# EAGLE design esp-rgbw (EAGLE 9.6.2)
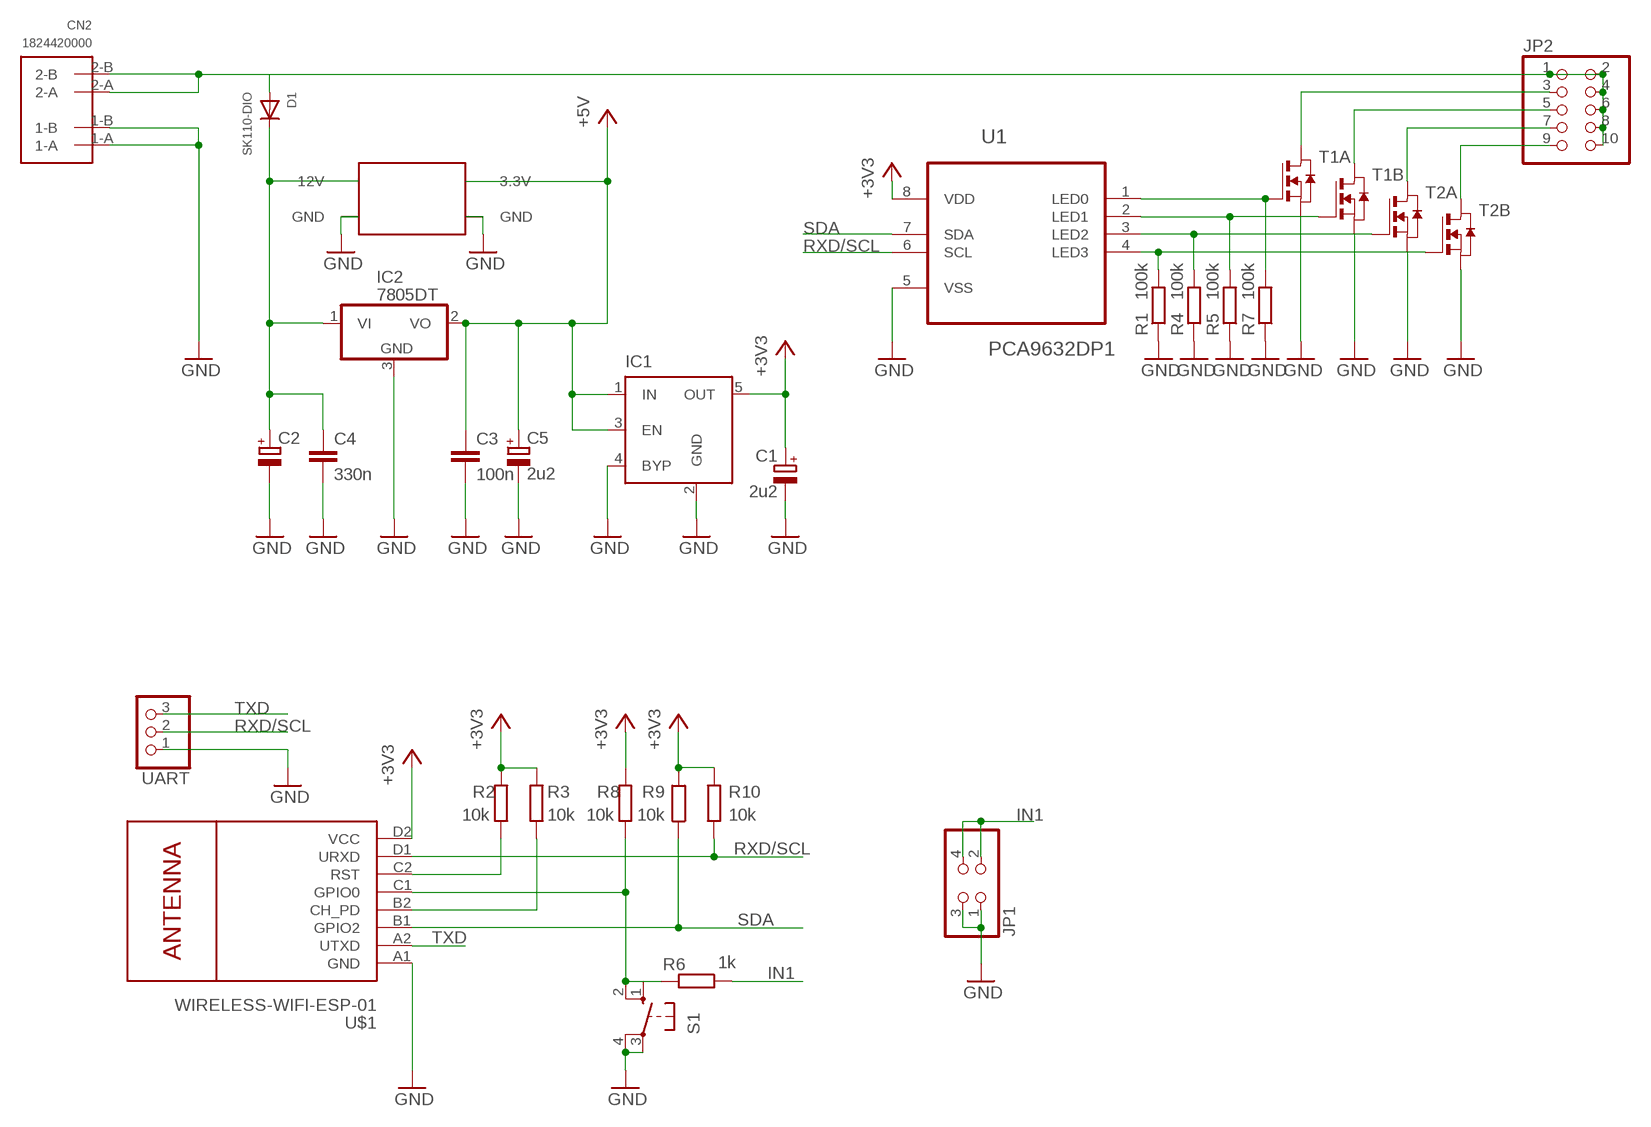
[diagram p0: schematic, sheet 1]

## Parts
C1  2u2  CPOL-EUSMCB  [SMC_B]
C2  CPOL-EUC/6032-28R  [C/6032-28R]
C3  100n  C-EUC0805  [C0805]
C4  330n  C-EUC0805  [C0805]
C5  2u2  CPOL-EUSMCB  [SMC_B]
CN2  1824420000  [1824420000]
D1  SK110-DIO  DIODESMA  [SMADIODE]
IC1  MIC5219XX  [SOT23-5]
IC2  7805DT  [TO252]
JP1  PINHD-2X2  [2X02]
JP2  PINHD-2X5  [2X05]
R1  100k  R-EU_R0805  [R0805]
R2  10k  R-EU_R0805  [R0805]
R3  10k  R-EU_R0805  [R0805]
R4  100k  R-EU_R0805  [R0805]
R5  100k  R-EU_R0805  [R0805]
R6  1k  R-EU_R0805  [R0805]
R7  100k  R-EU_R0805  [R0805]
R8  10k  R-EU_R0805  [R0805]
R9  10k  R-EU_R0805  [R0805]
R10  10k  R-EU_R0805  [R0805]
S1  10-XX  [B3F-10XX]
T1  NMOS2SO8  [SO8]
T2  NMOS2SO8  [SO8]
U1  PCA9632DP1  [SOP65P490X110-8N]
U$1  WIRELESS-WIFI-ESP-01  [WIRELESS-WIFI-ESP-01]
U$2  MP2307-MINI-360  [MP2307-MINI-360]
UART  PINHD-1X3  [1X03]

## Nets
+3V3: C1.+ IC1.5(OUT) R2.2 R3.2 R8.2 R9.2 R10.2 U1.8(VDD) U$1.D2(VCC)
+5V: C3.1 C5.+ IC1.1(IN) IC1.3(EN) IC2.2(VO) U$2.3.3V
GND: C1.- C2.- C3.2 C4.2 C5.- CN2.1-A CN2.1-B IC1.2(GND) IC1.4(BYP) IC2.3(GND) JP1.1 JP1.3 R1.1 R4.1 R5.1 R7.1 S1.3(P) S1.4(P1) T1.1(A:S) T1.3(B:S) T2.1(A:S) T2.3(B:S) U1.5(VSS) U$1.A1(GND) U$2.GND@1(GND) U$2.GND@2(GND) UART.1
IN1: JP1.2 JP1.4 R6.1
N$1: R3.1 U$1.B2(CH_PD)
N$2: R2.1 U$1.C2(RST)
N$4: R6.2 R8.1 S1.1(S) S1.2(S1) U$1.C1(GPIO0)
N$7: JP2.3 T1.7(A:D) T1.8(A:D)
N$8: JP2.5 T1.5(B:D) T1.6(B:D)
N$9: C2.+ C4.1 D1.C IC2.1(VI) U$2.12V
N$10: JP2.7 T2.7(A:D) T2.8(A:D)
N$12: JP2.9 T2.5(B:D) T2.6(B:D)
N$13: R1.2 T2.4(B:G) U1.4(LED3)
N$14: R4.2 T2.2(A:G) U1.3(LED2)
N$16: R5.2 T1.4(B:G) U1.2(LED1)
N$17: R7.2 T1.2(A:G) U1.1(LED0)
OUT+: CN2.2-A CN2.2-B D1.A JP2.1 JP2.2 JP2.4 JP2.6 JP2.8 JP2.10
RXD/SCL: R10.1 U1.6(SCL) U$1.D1(URXD) UART.2
SDA: R9.1 U1.7(SDA) U$1.B1(GPIO2)
TXD: U$1.A2(UTXD) UART.3

## Library data of the parts
C1 C2 C5 = rcl:CPOL-EU: POLARIZED CAPACITOR, European symbol; SPICEPREFIX: C
C3 C4 = rcl:C-EU: CAPACITOR, European symbol; SPICEPREFIX: C
CN2 = 1824420000:1824420000: Check availability <https://pricing.snapeda.com/parts/1824420000/Weidmuller/view-part?ref=eda>; AVAILABILITY: In Stock; CHECK_PRICES: https://www.snapeda.com/parts/1824420000/Weidmuller/view-part/?ref=eda; DESCRIPTION: 2 Position Wire to Board Terminal Block Horizontal with Board 0.138 (3.50mm) Through Hole; MF: Weidmuller; MP: 1824420000; PACKAGE: None; PRICE: None; SNAPEDA_LINK: https://www.snapeda.com/parts/1824420000/Weidmuller/view-part/?ref=snap
D1 = adafruit:DIODE: Diode SMADIODE - SMA Surface Mount Package 20V 1A Schottky Diode Digikey: 641-1014-6-ND DO-1N4148 - Through Hole Small Current Diode SOD-123 20V 1 A (.5mV Vf) Schottky Diode - Digikey: MBRX120TPMSCT-ND SOD-323 10V 570mA (.38mV Vf, 3ns) Schottky Diode - Digikey: ZLLS410CT-ND SOD-523 30V 30mA Schottky Diode (RB751S-40TE61) - Digikey: RB751S-40TE61CT-ND SOT23-R/W - SOT23 Package (R = Solder Paste/Reflow Ovens, W = Hand-Soldering) BAT54Film 40V 300mA - Digikey: 497-7162-1-ND
IC1 = v-reg-micrel:MIC5219XX: VOLTAGE REGULATOR; OC_FARNELL: unknown; OC_NEWARK: unknown
IC2 = linear:78*: Positive VOLTAGE REGULATOR Source: http://cache.national.com/ds/LM/LM78L05.pdf http://www.fairchildsemi.com/ds/LM/LM7805.pdf
JP1 = pinhead:PINHD-2X2: PIN HEADER
JP2 = pinhead:PINHD-2X5: PIN HEADER
R1-R10 = rcl:R-EU_: RESISTOR, European symbol; SPICEPREFIX: R
S1 = switch-omron:10-XX: OMRON SWITCH; MPN: B3F-1000; OC_FARNELL: 176432; OC_NEWARK: 36M3542
T1 T2 = zetex:NMOS2: Dual MOS FET; OC_FARNELL: unknown; OC_NEWARK: unknown
U1 = PCA9632DP1_118:PCA9632DP1
U$1 = diy-modules:WIRELESS-WIFI-ESP-01: Wireless Wi-Fi ESP-01 Module based on ESP8266 chip Click here to find device on ebay.com <http://www.ebay.com/sch/esp8266+esp+01+transceiver>
U$2 = MP2307-MINI-360:MP2307-MINI-360
UART = adafruit:PINHD-1X3: PIN HEADER

## Board
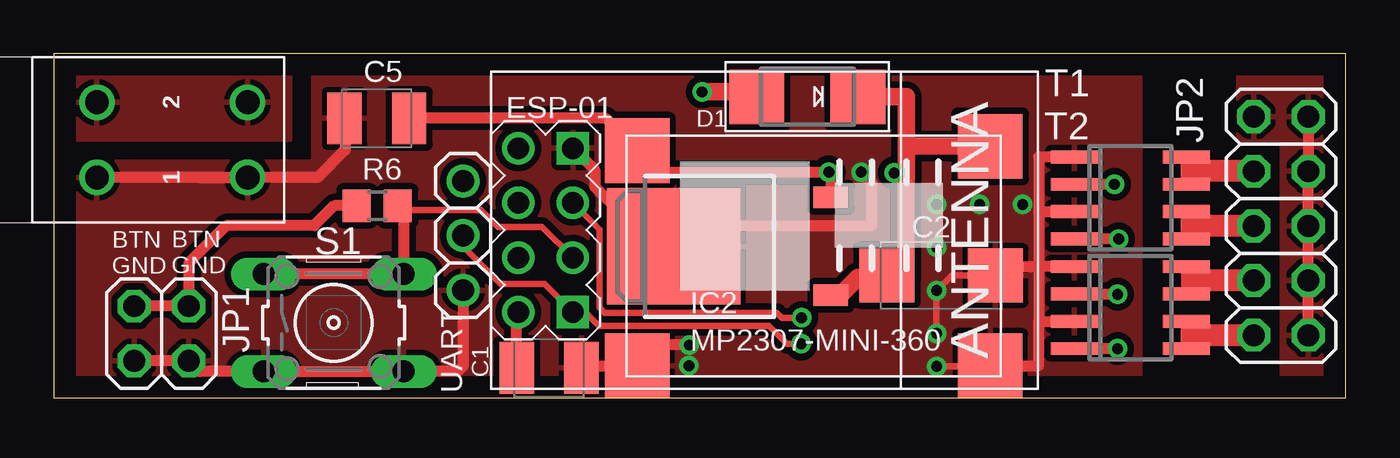
[diagram p1: board, top side]
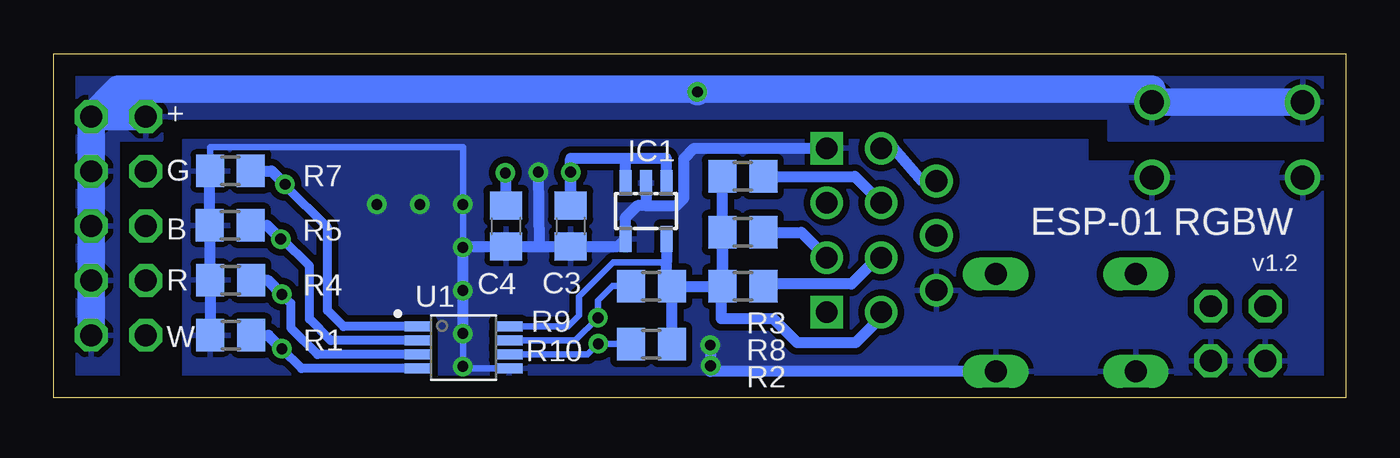
[diagram p2: board, bottom side, seen from below]

Size 60 x 16 mm. Coordinates in mm from the lower left corner, seen from the top.
Outline: 0,0 60,0 60,16 0,16 0,0
Copper layers (1*16): Top 0.035mm / dielectric 1.5mm / Bottom 0.035mm
Design rules "default *": minimum track width 6mil, minimum drill 0.35mm, track to track 12mil, track to pad 8mil, pad to pad 8mil, via to via 8mil, smd to smd 8mil, copper to edge 40mil, drill to drill 6mil, minimum pad ring 10mil, minimum via ring 8mil, stop-mask expansion 4mil, vias tented up to drill 0mil, thermal gap 10mil

### Footprints (pad centres in the part's own frame; a part is rotated, then mirrored left to right if it is on the bottom)
SMC_B = smd 1.6 x 2.4: + -1.5,0; - 1.5,0
C/6032-28R = smd 2.55 x 2.5: + 2.525,0; - -2.525,0
C0805 = smd 1.3 x 1.5: 1 -0.95,0; 2 0.95,0
1824420000 = drill 1.1: 1-A 1.75,3.5; 1-B 1.75,-3.5; 2-A -1.75,3.5; 2-B -1.75,-3.5
SMADIODE = smd 2.54 x 2.54: A 2.349,0; C -2.349,0
SOT23-5 = smd 0.55 x 1.2: 1 -0.95,-1.3; 2 0,-1.3; 3 0.95,-1.3; 4 0.95,1.3; 5 -0.95,1.3
TO252 = smd 1 x 1.6: 1 -2.28,-4.8; 2 2.28,-4.8 | smd 5.4 x 6.2: 3 0,2.5
2X02 = drill 1.016 octagon: 1 -1.27,-1.27; 2 -1.27,1.27; 3 1.27,-1.27; 4 1.27,1.27
2X05 = drill 1.016 octagon: 1 -5.08,-1.27; 2 -5.08,1.27; 3 -2.54,-1.27; 4 -2.54,1.27; 5 0,-1.27; 6 0,1.27; 7 2.54,-1.27; 8 2.54,1.27; 9 5.08,-1.27; 10 5.08,1.27
R0805 = smd 1.3 x 1.5: 1 -0.95,0; 2 0.95,0
B3F-10XX = drill 1.016 long: 1 -3.251,2.261; 2 3.251,2.261; 3 -3.251,-2.261; 4 3.251,-2.261
SO8 = smd 0.6 x 2.2: 1 -1.905,-2.6; 2 -0.635,-2.6; 3 0.635,-2.6; 4 1.905,-2.6; 5 1.905,2.6; 6 0.635,2.6; 7 -0.635,2.6; 8 -1.905,2.6
SOP65P490X110-8N = smd 1.25 x 0.46: 1 -2.11,0.975; 2 -2.11,0.325; 3 -2.11,-0.325; 4 -2.11,-0.975; 5 2.11,-0.975; 6 2.11,-0.325; 7 2.11,0.325; 8 2.11,0.975
WIRELESS-WIFI-ESP-01 = drill 1 square: A1 -8.89,3.81; D1 -8.89,-3.81 | drill 1: A2 -11.43,3.81; B1 -8.89,1.27; B2 -11.43,1.27; C1 -8.89,-1.27; C2 -11.43,-1.27; D2 -11.43,-3.81
MP2307-MINI-360 = smd 3 x 3: 3.3V 0.5,10.5; 12V 16.9,10.7; GND@1 16.9,0.5; GND@2 0.5,0.5
1X03 = drill 1.016: 1 -2.54,0; 2 0,0; 3 2.54,0

### Placement (x,y rotation side)
C1  23,1.4 0 top
C2  41.21,5.7 180 top
C3  36,8 270 bottom
C4  39,8 270 bottom
C5  15,13 180 top
CN2  5.5,12 270 top
D1  35,14 180 top
IC1  32.5,8.7 180 bottom
IC2  31.29,7.05 90 top
JP1  5,3 0 top
JP2  57,8 270 top
R1  51.78,2.92 0 bottom
R2  27.99,5.2 180 bottom
R3  28,10.3 180 bottom
R4  51.79,5.48 0 bottom
R5  51.81,8.03 0 bottom
R6  15.02,8.94 0 top
R7  51.8,10.56 0 bottom
R8  28,7.7 180 bottom
R9  32.25,5.2 0 bottom
R10  32.25,2.5 0 bottom
S1  13,3.5 0 top
T1  50,9.3 270 top
T2  50,4.2 270 top
U1  40.97,2.35 0 bottom
U$1  33,7.8 0 top
U$2  26.59,1 0 top
UART  19.01,7.55 90 top

### Tracks (layer width: path | path; a pad name or v marks a point on that pad's centre or on a via)
+3V3
  Top 0.508: C1.+ 21.5,3.72 U$1.D2
  Bottom 0.305: U1.8 36.12,3.33 35.6,3.85 35.6,4.73 34.02,6.31 31.55,6.31 | R9.2 31.55,5.45
  Bottom 0.508: U$1.D2 21.57,3.76 22.75,2.58 25.47,2.58 26.59,3.7 29,3.7 29,5.19 | R2.2 28.94,10.6 R3.2 | 29,5.19 29,5.2 R2.2 | R8.2 R2.2 | 29,5.19 31.28,5.19 R9.2 R10.2 | IC1.5 31.55,6.31 31.55,5.45
+5V  (via drill 0.5)
  Top 0.508: 35.85,10.5 28,10.5 28,10.59 U$2.3.3V 27.09,11.54 25.63,13 C5.+ | 35.85,10.5 v36,10.5 | IC2.2 36.09,10.26 35.85,10.5
  Bottom 0.508: IC1.1 31.55,11.14 33.45,11.14 | 33.45,11.14 36,11.14 C3.1 v36,10.5 | IC1.3 33.45,11.14
GND  (via drill 0.5)
  Top 0.305: U$2.GND@1 43.46,1.47 v41,1.47 | v41,3 v41,5 41.7,5.7 C2.-
  Top 0.508: 6.77,10.25 CN2.1-A | CN2.1-A CN2.1-B | 29,8 28,7 28.78,7 IC2.3 | 29,8 37.95,8 38,8.05 38,10 v37.5,10.5 | UART.1 19.01,1.5 18.78,1.27 16.25,1.27 16.22,1.24 S1.3 6.76,1.24 JP1.3 JP1.1 | C1.- 24.6,1.5 U$2.GND@2 27.5,1.5 | 27.5,1.5 27.73,1.27 28,1.27 | C5.- 13.54,12.96 13.54,11.54 12.25,10.25 CN2.1-A | U$1.A1 25.13,10.59 25.13,9.81 25.94,9 29,9 29,8 | v29.51,2.46 28.46,2.46 27.5,1.5 | T1.1 45.74,11.21 45.74,8.66 | 45.74,8.66 T1.3 | 45.74,8.66 45.74,6.11 | 45.74,6.11 45.74,3.56 | 45.74,3.56 T2.3 | T2.1 45.74,6.11 | C2.- 43.73,6.11 45.74,6.11 | U$2.GND@1 45.74,1.5 45.74,3.56
  Bottom 0.305: U1.5 40.91,1.38 v41,1.47 v41,3 | R7.1 52.75,11.67 49.84,11.67 49.84,11.66 41,11.66 41,7.05
  Bottom 0.508: 37.49,7.05 C4.2 41,7.05 v41,3 | 37.49,7.05 C3.2 | C3.2 36,6.83 | IC1.2 32.49,8.94 | C3.2 33.8,7.05 IC1.4 33.45,8.39 32.9,8.94 32.49,8.94 | v37.5,10.5 37.46,7.08 37.49,7.05 | R1.1 R4.1 52.74,8.01 R5.1 R7.1 | S1.4 29.51,1.24 v29.51,2.46 | 32.49,8.94 31.09,8.94 30.74,9.29 30.74,11.13 30.26,11.61 U$1.A1
  other vias: 43,9 45,9 41,9 41,7 29.5,1.5
  pour Top: 12,16 12,11.04 0,11.04 0,0 50.51,0 50.51,16
  pour Bottom: 0,11 12,11 12,12 54,12 54,0 0,0
IN1
  Top 0.508: JP1.2 JP1.4 6.27,6.27 8.01,8.01 12.1,8.01 13.03,8.94 R6.1
N$1
  Bottom 0.508: R3.1 22.8,10.3 U$1.B2
N$2
  Bottom 0.508: U$1.C2 21.69,6.53 21.74,6.51 22.96,5.29 26.75,5.29 R2.1
N$4
  Top 0.305: U$1.C1 22.68,7.96 20.63,7.96 19.84,8.75 16.25,8.75 S1.2
  Top 0.508: S1.1 S1.2 16.25,8.66 R6.2
  Bottom 0.508: R8.1 25.28,7.7 U$1.C1
N$7
  Top 0.508: T1.7 52.6,10.54 | 52.6,10.54 T1.8 | 53,10.54 52.6,10.54
  Top 1.016: JP2.3 53,10.54
N$8
  Top 0.508: T1.5 52.6,8 | 52.6,8 T1.6 | 53,8 52.6,8
  Top 1.016: JP2.5 53,8
N$9  (via drill 0.5)
  Top 0.508: 39.57,10.24 39.35,10.46 v39.03,10.46 39.27,10.21 39.59,10.21 | U$2.12V 43,11.7
  Top 0.813: IC2.1 36.51,4.77 37.35,5.61 38.81,5.61 C2.+ 39.57,5.58 39.57,10.24 | D1.C 39.59,14 39.59,11.7 | 39.59,11.7 39.59,10.21 | 43,11.7 39.59,11.7
  Bottom 0.508: C4.1 39,10.43 v39.03,10.46
N$10
  Top 0.508: T2.8 52.6,5.48 | 52.6,5.48 T2.7 | 53,5.46 52.62,5.46 52.6,5.48
  Top 1.016: JP2.7 53,5.46
N$12
  Top 0.508: T2.5 52.6,3 | 52.6,3 T2.6 | 53,3 52.6,3
  Top 1.016: JP2.9 53.08,2.92 53,3
N$13  (via drill 0.5)
  Top 0.508: v49.41,2.29 T2.4
  Bottom 0.406: U1.4 48.49,1.38 v49.41,2.29
  Bottom 0.508: R1.2 50.04,2.92 v49.41,2.29
N$14  (via drill 0.5)
  Top 0.508: v49.41,4.82 47.41,4.82 T2.2
  Bottom 0.406: U1.3 47.76,2.02 48.99,3.26 48.99,4.4 v49.41,4.82
  Bottom 0.508: R4.2 50.07,5.48 v49.41,4.82
N$16  (via drill 0.5)
  Top 0.508: v49.46,7.39 T1.4
  Bottom 0.406: U1.2 47.13,2.67 48.13,3.67 48.13,6.13 49.39,7.39 v49.46,7.39
  Bottom 0.508: R5.2 50.1,8.03 v49.46,7.39
N$17  (via drill 0.5)
  Top 0.508: v49.26,9.93 T1.2
  Bottom 0.406: U1.1 46.55,3.33 47.29,4.07 47.29,7.91 49.26,9.89 v49.26,9.93
  Bottom 0.508: R7.2 49.89,10.56 v49.26,9.93
OUT+  (via drill 0.5)
  Top 0.508: JP2.10 JP2.8 JP2.6 JP2.4 JP2.2
  Top 0.813: D1.A 32.63,14.23 v30.11,14.23
  Bottom 0.508: 7,13.75 6.27,13.75 | v30.11,14.23 29.99,14.35
  Bottom 0.813: CN2.2-A 7,13.75 | 6.27,13.75 CN2.2-B
  Bottom 1.27: 29.99,14.35 9,14.35 CN2.2-A CN2.2-B | v30.11,14.23 30.23,14.35 57,14.35 JP2.2 | JP2.2 JP2.10 | JP2.2 JP2.1
  pour Top: 57,0 60,0 60,16 55,16 55,12 57,12
  pour Top: 0,12 0,16 11,16 11,12
  pour Bottom: 0,12 0,16 60,16 60,0 57,0 57,12 55,12 55,13 11,13 11,12
RXD/SCL  (via drill 0.5)
  Top 0.3: U$1.D1 24.7,3.99 25.33,3.35 33.21,3.35 34.04,2.52 v34.71,2.52
  Top 0.305: U$1.D1 22.79,5.31 20.75,5.31 19.01,7.05 UART.2
  Bottom 0.305: R10.1 33.23,2.5 33.23,2.49 33.26,2.52 v34.71,2.52 35.2,2.02 U1.6
SDA  (via drill 0.5)
  Top 0.3: U$1.B1 25.34,7.84 25.34,4.2 25.58,3.96 33.59,3.96 33.82,3.73 v34.73,3.73
  Bottom 0.305: R9.1 34.06,5.2 34.73,4.53 v34.73,3.73 35.78,2.67 U1.7
TXD
  Bottom 0.508: UART.3 19.69,10.09 21.01,11.61 U$1.A2

### Text on the board
tNames: ESP-01 | BTN / GND | BTN / GND
bNames: + | G | ESP-01 RGBW | v1.2 | B | R | W